# EAGLE design LED_heart2 (EAGLE 9.1.0)
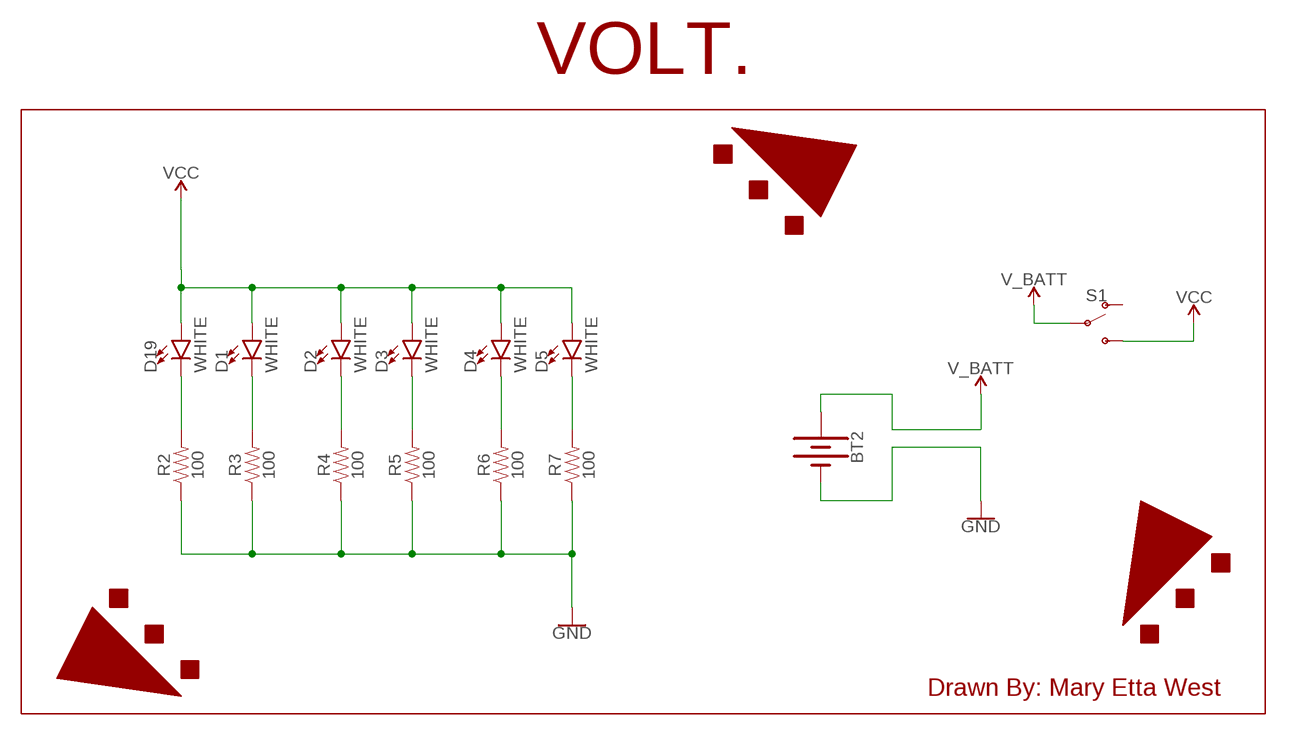
[diagram p0: schematic, sheet 1]

## Parts
BT2  BATTERY-12MM_SMD  [BATTCON_12MM]
D1  WHITE  LED-WHITE1206  [LED-1206]
D2  WHITE  LED-WHITE1206  [LED-1206]
D3  WHITE  LED-WHITE1206  [LED-1206]
D4  WHITE  LED-WHITE1206  [LED-1206]
D5  WHITE  LED-WHITE1206  [LED-1206]
D19  WHITE  LED-WHITE1206  [LED-1206]
R2  100  100OHM-0603-1/4W-5%  [0603]
R3  100  100OHM-0603-1/4W-5%  [0603]
R4  100  100OHM-0603-1/4W-5%  [0603]
R5  100  100OHM-0603-1/4W-5%  [0603]
R6  100  100OHM-0603-1/4W-5%  [0603]
R7  100  100OHM-0603-1/4W-5%  [0603]
S1  SWITCH-SPDT-SMD-RIGHT-ANGLE  [SWITCH_SPST_SMD_A]

## Nets
GND: BT2.GND(-) R2.1 R3.1 R4.1 R5.1 R6.1 R7.1
N$2: D19.C R2.2
N$3: D1.C R3.2
N$4: D2.C R4.2
N$5: D3.C R5.2
N$6: D4.C R6.2
N$7: D5.C R7.2
V_BATT: BT2.PWR@1(+) S1.2(P)
VCC: D1.A D2.A D3.A D4.A D5.A D19.A S1.3(S)
Unconnected: S1.1(O)

## Notes on the sheet
- VOLT.
- Drawn By: Mary Etta West

## Library data of the parts
BT2 = SparkFun-Batteries:BATTERY: Battery - Single Cell A variety of battery chemistries, sizes, and footprints. Device List: 20MM_PTH - Coin Cell Battery Holder - 20mm (PTH) <https://www.sparkfun.com/products/783> 6.8MM_PTH - Coin Cell Battery Holder - 6.8MM(SMD) <https://www.digikey.com/product-detail/en/seiko-instruments/MS621FE-FL11E/728-1057-ND/1889208?WT.srch=1&gclid=CNOQ5a6LzdQCFZS2wAodXCkE0g> 12MM_SMD - Coin Cell Battery Holder - 12mm (SMD) <https://www.sparkfun.com/products/10592> 12MM_PTH - Coin Cell Battery Holder - 12mm (PTH) <https://www.sparkfun.com/products/7948> 20MM_SMD - 20mm Coin Cell Battery Holder (SMD) (2 legs) Used on the Big Time Watch Kit <https://www.sparkfun.com/products/11734> 20MM_SMD_4LEGS - Coin Cell Battery Holder - 20mm (SMD) <https://www.sparkfun.com/products/11892> 20MM_SMD_4LEGS_OVERPASTE - Coin Cell Battery Holder - 20mm (SMD) <https://www.sparkfun.com/products/11892> (Over-paste on the legs) 24.5MM_PTH - Coin Cell Battery Holder - 24.5mm (PTH) <https://www.sparkfun.com/products/8863> 9V - 9V Battery Holder - PC Mount Used on the SparkFun SparkPunk Sound Kit <https://www.sparkfun.com/products/11177> and SparkFun SparkPunk Sequencer Kit <https://www.sparkfun.com/products/12707> 18650 - Battery Holder - 18650 (PTH) <https://www.sparkfun.com/products/13113> AA - Battery Holder - 1xAA (PTH) <https://www.sparkfun.com/products/7949> AAA - Battery Holder - 1xAAA (PTH) <https://www.sparkfun.com/products/12718> AA_KIT - Battery Holder - 1xAA (PTH) <https://www.sparkfun.com/products/7949> Special kit package - pads only have exposed copper on one side of the board. AAA_KIT - Battery Holder - 1xAAA (PTH) <https://www.sparkfun.com/products/12718> Special kit package - pads only have exposed copper on one side of the board.; PROD_ID: BATT-08044; SF_SKU: PRT-10592
D1-D5 D19 = SparkFun-LED:LED-WHITE: White SMD LED Used in manufacturing several products at SparkFun. Packages: 0603 - Bright White SMD 0603 package[Product Link] <http://www.kingbrightusa.com/product.asp?catalog_name=LED&product_id=APT1608QWF/D> 1206 - Bright White SMD1206 package [Product Link] <http://www.kingbrightusa.com/product.asp?catalog_name=LED&product_id=APT3216QWF/D> 3014 - Super Bright SMD 3014 package [Datasheet] <http://www.lumileds.com/uploads/459/DS208-pdf> SparkFun Products: Blackberry Trackballer Breakout <https://www.sparkfun.com/products/13169> Digital SandBox <https://www.sparkfun.com/products/12651>; PROD_ID: DIO-09955
R2-R7 = SparkFun-Resistors:100OHM: 100Ω resistor A resistor is a passive two-terminal electrical component that implements electrical resistance as a circuit element. Resistors act to reduce current flow, and, at the same time, act to lower voltage levels within circuits. - Wikipedia; PROD_ID: RES-12438
S1 = SparkFun-Switches:SWITCH-SPDT: Single Pole, Double Throw (SPDT) Switch Single-pole, double-throw (SPDT) switch. Variant Overview SMD-AYZ0202 Surface Mount DPDT Switch <https://www.sparkfun.com/products/597> (COM-00597) Used on e.g. LilyPad Arduino USB - ATmega32U4 Board <https://www.sparkfun.com/products/12049> PTH-11.6X4.0MM SPDT Mini Power Switch <https://www.sparkfun.com/products/102> (COM-00102) Used on e.g. SparkFun Simon Says - Through-Hole Soldering Kit <https://www.sparkfun.com/products/10547> (KIT-10547) PTH-11.6X4.0MM-KIT KIT version of SPDT Mini Power Switch - Simplifies soldering by removing tStop of switch pins - only one side can be soldered. PTH-11.6X4.0MM-LOCK LOCK version of SPDT Mini Power Switch - Offset pins hold switch in place for easier soldering. SMD-RIGHT-ANGLE Surface Mount Right Angle Switch <https://www.sparkfun.com/products/10860> (COM-10860) Used on e.g. SparkFun ESP8266 Thing <https://www.sparkfun.com/products/13231>; PROD_ID: SWCH-10651; SF_SKU: COM-10860

## Board
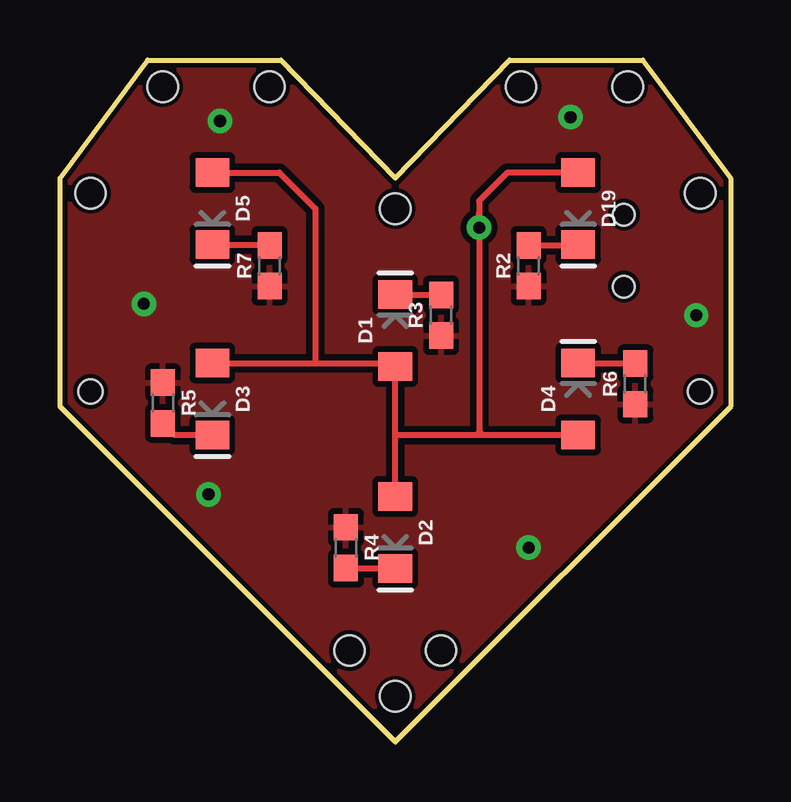
[diagram p1: board, top side]
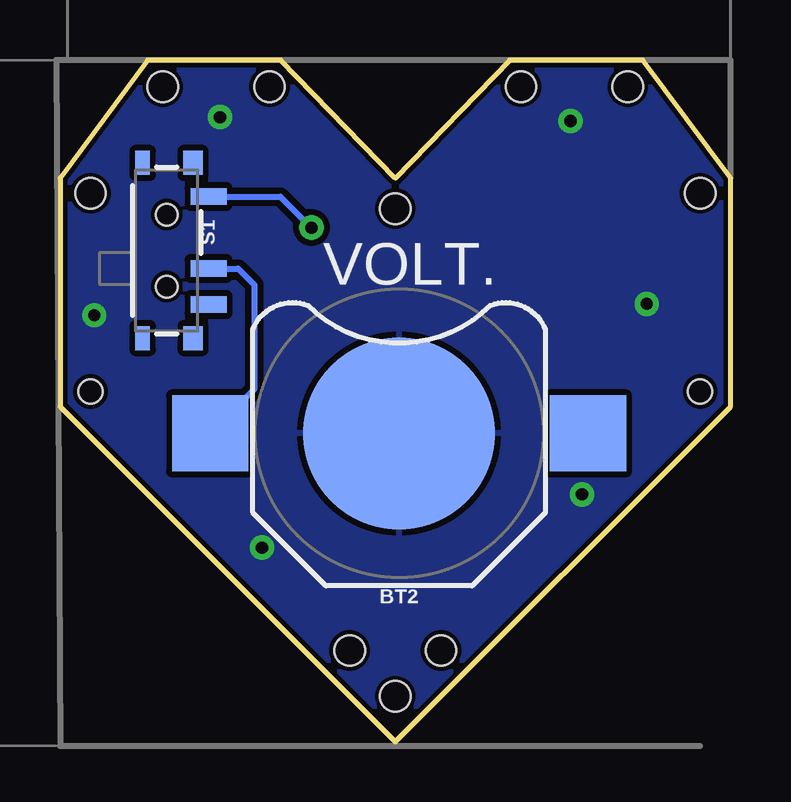
[diagram p2: board, bottom side, seen from below]

Size 27.94 x 28.42 mm. Coordinates in mm from the lower left corner, seen from the top.
Outline: 13.97,23.49 18.73,28.42 24.29,28.42 27.94,23.49 27.94,13.97 13.97,0 0,13.97 0,23.49 3.65,28.42 9.21,28.42 13.97,23.49
Copper layers (1*16): Top 0.035mm / dielectric 1.5mm / Bottom 0.035mm
Design rules "SparkFun-2-layer-STANDARD": minimum track width 10mil, minimum drill 20mil, track to track 10mil, track to pad 8mil, pad to pad 8mil, via to via 10mil, smd to smd 8mil, copper to edge 8mil, drill to drill 8mil, minimum pad ring 10mil, minimum via ring 10mil, stop-mask expansion 4mil, vias tented up to drill 25mil, thermal gap 10mil
Holes 1.27 mm at 13.97,1.91 13.97,22.22 19.21,27.3 4.29,27.3 1.27,22.86 26.67,22.86 8.73,27.3 23.65,27.3 12.06,3.81 15.88,3.81
Holes 1.02 mm at 1.27,14.61 26.67,14.61

### Footprints (pad centres in the part's own frame; a part is rotated, then mirrored left to right if it is on the bottom)
BATTCON_12MM = smd 8 x 8: GND 0,0 | smd 3.175 x 3.175: PWR@1 -7.874,0; PWR@2 7.874,0
LED-1206 = smd 1.2 x 1.4: A -1.5,0; C 1.5,0
0603 = smd 1.1 x 1: 1 -0.85,0; 2 0.85,0
SWITCH_SPST_SMD_A = smd 0.7 x 1.5: 1 -2.25,-1.75; 2 -0.75,-1.75; 3 2.25,-1.75 | smd 1 x 0.6: GND1 -3.65,1; GND3 3.65,1 | smd 1 x 0.8: GND2 -3.65,-1.1; GND4 3.65,-1.1 | hole 0.9: -1.5,0; 1.5,0

### Placement (x,y rotation side)
BT2  13.81,12.86 0 bottom
D1  13.97,17.14 90 top
D2  13.97,8.73 270 top
D3  6.35,14.29 270 top
D4  21.59,14.29 90 top
D5  6.35,22.22 270 top
D19  21.59,22.22 270 top
R2  19.53,19.84 90 top
R3  15.88,17.78 90 top
R4  11.91,8.1 270 top
R5  4.29,14.13 270 top
R6  23.97,14.92 90 top
R7  8.73,19.84 90 top
S1  23.49,20.48 90 bottom

### Tracks (layer width: path | path; a pad name or v marks a point on that pad's centre or on a via)
GND  (via drill 0.51)
  other vias: 6.67,25.88 3.49,18.26 21.27,26.04 26.51,17.78 19.53,8.1 6.19,10.32
  pour Bottom: 13.97,23.49 18.73,28.42 24.29,28.42 27.94,23.49 27.94,13.97 13.97,0 0,13.97 0,23.49 3.65,28.42 9.05,28.57
  pour Top: 13.97,23.49 18.73,28.42 24.29,28.42 27.94,23.49 27.94,13.97 13.97,0 0,13.97 0,23.49 3.65,28.42 9.21,28.42 13.81,23.65
N$2
  Top 0.254: R2.2 21.56,20.69 D19.C
N$3
  Top 0.254: D1.C 15.86,18.64 R3.2
N$4
  Top 0.254: R4.2 13.95,7.25 D2.C
N$5
  Top 0.254: D3.C 4.78,12.79 R5.2
N$6
  Top 0.254: D4.C 23.96,15.79 R6.2
N$7
  Top 0.254: D5.C 8.7,20.72 R7.2
V_BATT
  Bottom 0.254: S1.2 20.52,19.73 19.84,19.05 19.84,14.7 BT2.PWR@1
VCC  (via drill 0.51)
  Top 0.254: D2.A 13.97,12.7 | 13.97,12.7 13.97,15.56 | 13.97,15.56 D1.A | D4.A 17.62,12.79 | 17.62,12.79 14.06,12.79 13.97,12.7 | D3.A 10.64,15.79 | 10.64,15.79 13.74,15.79 13.97,15.56 | D5.A 9.14,23.72 10.64,22.22 10.64,15.79 | D19.A 18.64,23.72 17.46,22.54 17.46,22.07 | 17.46,22.07 v17.46,21.43 | v17.46,21.43 17.46,12.95 17.62,12.79 | v17.46,21.43 17.46,22.07
  Bottom 0.254: S1.3 18.76,22.73 v17.46,21.43

### Text on the board
bPlace: VOLT.